# Altium schematic sheet V2.0.SchDoc
size 177 x 88 mm
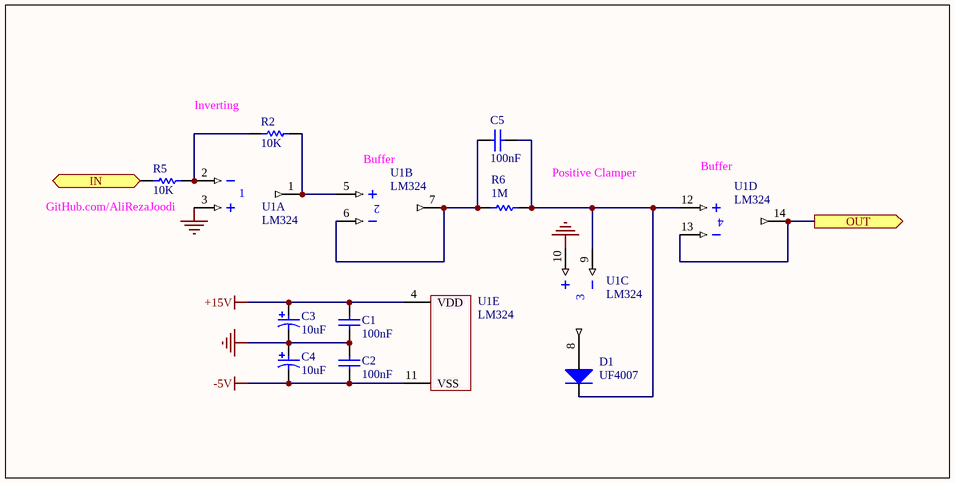
[diagram p0: V2.0.SchDoc]

## Parts
C1  value 100nF  [CAPNTO2.54-3.05x1.78A]  (hidden comment: Cap)
C2  value 100nF  [CAPNTO2.54-3.05x1.78A]  (hidden comment: Cap)
C3  10uF  [C_THD_EL_(P2.54-D6-H11)]
C4  10uF  [C_THD_EL_(P2.54-D6-H11)]
C5  100nF  [CAPNTO2.54-3.05x1.78A]
D1  UF4007  [DIODE-0.4]
R2  10K  [AXIAL-0.4]
R5  10K  [AXIAL-0.4]
R6  1M  [AXIAL-0.4]
U1  LM324  [646-06]  (parts A,B,C,D,E of 5)

## Ports
IN (in), OUT (out)

## Nets
+15V: C1.1 C3.1 U1.4(VDD)
-5V: C2.2 C4.2 U1.11(VSS)
GND: C1.2 C2.1 C3.2 C4.1 U1.3(IN+) U1.10(IN+)
IN: R5.2 ; port IN
OUT: U1.13(IN-) U1.14(OUT) ; port OUT
NetC5_1: C5.1 D1.2(K) R6.1 U1.9(IN-) U1.12(IN+)
NetC5_2: C5.2 R6.2 U1.6(IN-) U1.7(OUT)
NetD1_1: D1.1(A) U1.8(OUT)
NetR2_1: R2.1 R5.1 U1.2(IN-)
NetR2_2: R2.2 U1.1(OUT) U1.5(IN+)

## Notes on the sheet
- (near R2) Inverting
- (near U1) Buffer
- (near R5) GitHub.com/AliRezaJoodi
- Positive Clamper

## Library data of the parts
C1 C2 C5 = Cap: Capacitor; Manufacturer: Generic Components; Class I: Passive; Published: 8-Jun-2000; Revision: July-2002: Re-released for DXP Platform.; Publisher: Altium Limited; Class II: Capacitor
C3 C4 = Capacitor_Electrolytic: Capacitor, Electrolytic; Revision: July-2002: Re-released for DXP Platform.
D1 = Diode: Default Diode; Manufacturer: Generic Components; Class I: Discrete; Class II: Diode - Switching; Published: 8-Jun-2000; Revision: July-2002: Re-released for DXP Platform.; Publisher: Altium Limited
R2 R5 R6 = Res1: Resistor; Published: 8-Jun-2000; LatestRevisionDate: 17-Jul-2002; LatestRevisionNote: Re-released for DXP Platform.; PackageReference: AXIAL-0.3; Publisher: Altium Limited
U1 = LM324: Quad Low-Power Operational Amplifier; Published: 17-Jul-2002; LatestRevisionDate: 06-Jun-2005; LatestRevisionNote: Stylized 3D Model Added.; DatasheetVersion: 1988; PackageVersion: 1997; PackageReference: 646-06; Publisher: Altium Limited; PackageDescription: DIP; 14 Leads; Row Spacing 7.62 mm; Pitch 2.54 mm; ComponentLink1Description: Manufacturer Link; ComponentLink1URL: http://www.onsemi.com/site/products/parametrics/0,4446,251,00.html; ComponentLink2Description: Datasheet; ComponentLink2URL: http://www.onsemi.com/pub/Collateral/LM324-D.PDF